# Altium schematic sheet 1N4148WS-7-F.schdoc
size 127 x 101 mm
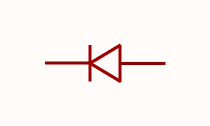
[diagram p0: 1N4148WS-7-F.schdoc]

## Parts
D?  1N4148WS-7-F  [SOD-323_L1.8-W1.3-LS2.5-RD]  (value not drawn)

## Nets

Not connected (* = marked no-connect by the designer): D? 1(C) 2(A)

## Library data of the parts
D? = 1N4148WS-7-F: Manufacturer: DIODES(美台); Add into BOM: yes; Diode Configuration: Independent Type; Forward Voltage (Vf@If): 1.25V@150mA; Reverse Leakage Current: 1uA@75V; Symbol: 1N4148WS-7-F; Device: 1N4148WS-7-F; LCSC Part Name: 电压:75V 电流:150mA; Supplier Part: C60580; Manufacturer Part: 1N4148WS-7-F; Supplier Footprint: SOD-323; JLCPCB Part Class: Extended Part; Datasheet: https://atta.szlcsc.com/upload/public/pdf/source/20160107/1457707747110.pdf; Supplier: LCSC; Convert to PCB: yes; Operating Temperature: -65℃~+150℃@(Tj)